# EAGLE design Emon3PVoltageV1.3 (EAGLE 6.4)
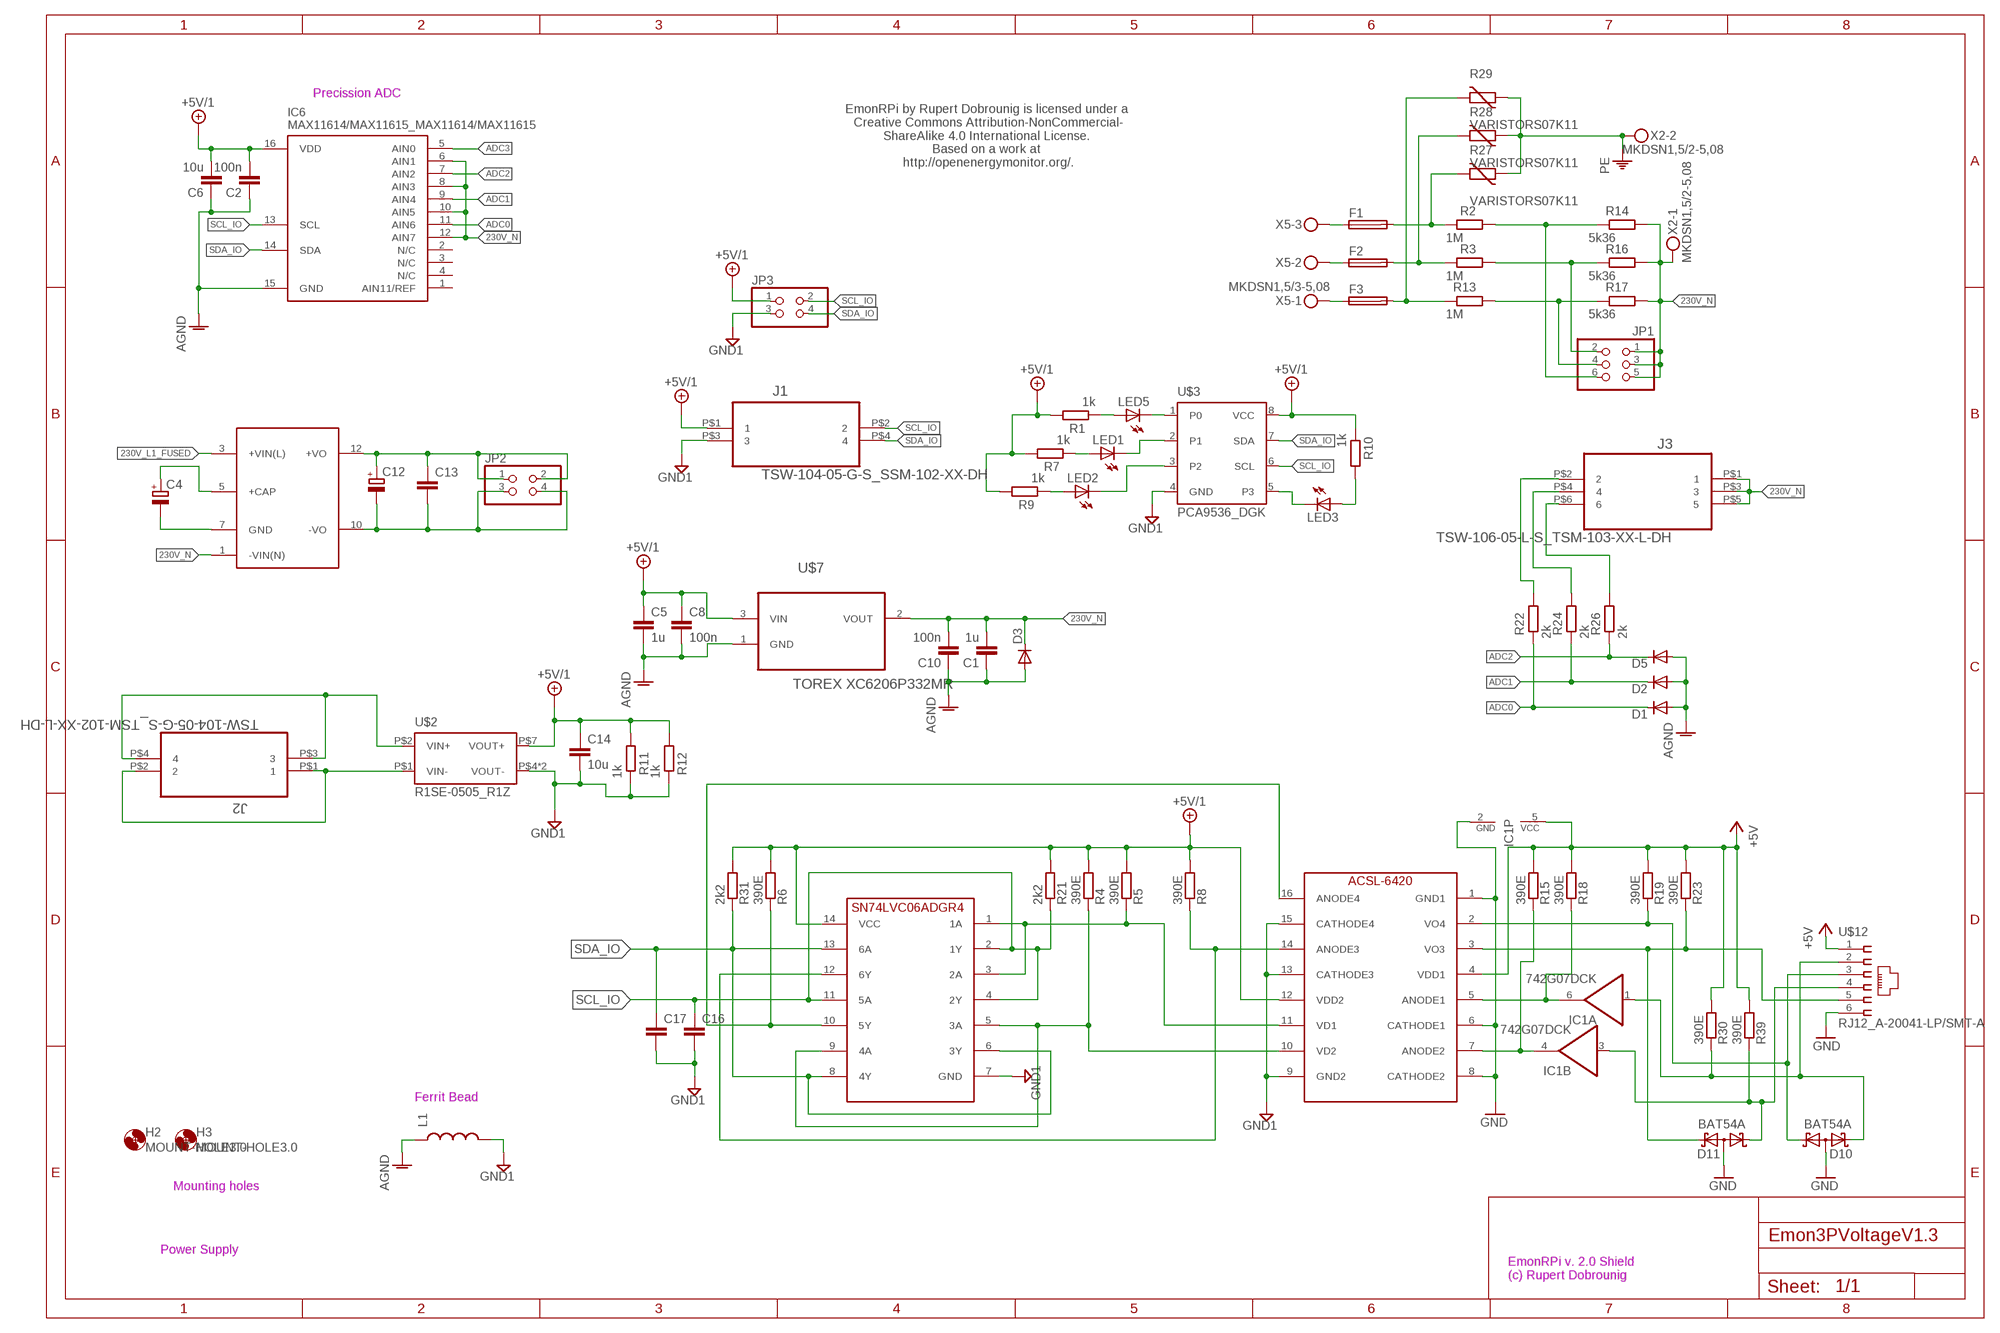
[diagram p0: schematic, sheet 1]

## Parts
C1  1u  C-EUC0805  [C0805]
C2  100n  C-EUC0805  [C0805]
C4  CPOL-EUE5-13  [E5-13]
C5  1u  C-EUC0805  [C0805]
C6  10u  C-EUC0805  [C0805]
C8  100n  C-EUC0805  [C0805]
C10  100n  C-EUC0805  [C0805]
C12  CPOL-EUE5-10.5  [E5-10,5]
C13  C-EUC0805  [C0805]
C14  10u  C-EUC0805  [C0805]
C16  C-EUC0805  [C0805]
C17  C-EUC0805  [C0805]
D1  DIODE-SOD523  [SOD523]
D2  DIODE-SOD523  [SOD523]
D3  DIODE-SOD523  [SOD523]
D5  DIODE-SOD523  [SOD523]
D10  BAT54A  [SOT23]
D11  BAT54A  [SOT23]
F1  TE5  [TE5]
F2  TE5  [TE5]
F3  TE5  [TE5]
H2  MOUNT-HOLE3.0  [3,0]
H3  MOUNT-HOLE3.0  [3,0]
IC1  742G07DCK  [SC70-6]
IC6  MAX11614/MAX11615_MAX11614/MAX11615  [QSOP16_2]
J1  TSW-104-05-G-S_SSM-102-XX-DH  [SAMTEC_SSM-102-XX-DH]
J2  TSW-104-05-G-S_TSM-102-XX-L-DH  [SAMTEC_TSM-102-XX-L-DH]
J3  TSW-106-05-L-S_TSM-103-XX-L-DH  [SAMTEC_TSM-103-XX-L-DH]
JP1  PINHD-2X3  [2X03]
JP2  PINHD-2X2  [2X02]
JP3  PINHD-2X2  [2X02]
L1  INDUCTOR0805  [0805]
LED1  LEDCHIPLED_1206  [CHIPLED_1206]
LED2  LEDCHIPLED_1206  [CHIPLED_1206]
LED3  LEDCHIPLED_1206  [CHIPLED_1206]
LED5  LEDCHIPLED_1206  [CHIPLED_1206]
R1  1k  R-EU_R1206  [R1206]
R2  1M  R-EU_0207/12  [0207/12]
R3  1M  R-EU_0207/12  [0207/12]
R4  390E  R-EU_R1206  [R1206]
R5  390E  R-EU_R1206  [R1206]
R6  390E  R-EU_R1206  [R1206]
R7  1k  R-EU_R1206  [R1206]
R8  390E  R-EU_R1206  [R1206]
R9  1k  R-EU_R1206  [R1206]
R10  1k  R-EU_R1206  [R1206]
R11  1k  R-EU_R1206  [R1206]
R12  1k  R-EU_R1206  [R1206]
R13  1M  R-EU_0207/12  [0207/12]
R14  5k36  R-EU_R1206  [R1206]
R15  390E  R-EU_R1206  [R1206]
R16  5k36  R-EU_R1206  [R1206]
R17  5k36  R-EU_R1206  [R1206]
R18  390E  R-EU_R1206  [R1206]
R19  390E  R-EU_R1206  [R1206]
R21  2k2  R-EU_R1206  [R1206]
R22  2k  R-EU_R1206  [R1206]
R23  390E  R-EU_R1206  [R1206]
R24  2k  R-EU_R1206  [R1206]
R26  2k  R-EU_R1206  [R1206]
R27  VARISTORS07K11  [S07K11]
R28  VARISTORS07K11  [S07K11]
R29  VARISTORS07K11  [S07K11]
R30  390E  R-EU_R1206  [R1206]
R31  2k2  R-EU_R1206  [R1206]
R39  390E  R-EU_R1206  [R1206]
U$1  LS03-15BXXSR2  [LS03]
U$2  R1SE-0505_R1Z  [R1Z]
U$3  PCA9536_DGK  [DGK_S-PDSO-G8]
U$7  TOREX XC6206P332MR  MCP1700T-3302E/TT  [SOT95P237X112-3N]
U$10  ACSL-6420  [SO16]
U$11  SN74LVC06ADRG4  [SO-14]
U$12  RJ12_A-20041-LP/SMT-A  [A-2004-1-LP-SMT-B]
X2  MKDSN1,5/2-5,08  [MKDSN1,5/2-5,08]
X5  MKDSN1,5/3-5,08  [MKDSN1,5/3-5,08]

## Nets
230V_L1_FUSED [power]: F1.2 R2.2 R27.2 U$1.3(+VIN(L))
230V_N [230N]: C1.2 C10.2 D3.C IC6.6(AIN1) IC6.8(AIN3) IC6.10(AIN5) IC6.12(AIN7) J3.P$1 J3.P$3 J3.P$5 JP1.1 JP1.3 JP1.5 R14.1 R16.1 R17.1 U$1.1(-VIN(N)) U$7.2(VOUT) X2.1
+5V: IC1.5(P:VCC) R15.2 R18.2 R19.2 R23.2 R30.2 R39.2 U$10.4(VDD1) U$12.1
+5V/1 [power-converted]: C2.2 C5.1 C6.2 C8.1 C14.1 IC6.16(VDD) J1.P$1 JP3.1 R1.1 R4.2 R5.2 R6.2 R7.1 R8.2 R9.1 R10.2 R11.1 R12.1 R21.2 R31.2 U$2.P$7(VOUT+) U$3.8(VCC) U$7.3(VIN) U$10.12(VDD2) U$11.14(VCC)
ADC0: D1.C IC6.11(AIN6) R22.2
ADC1: D2.C IC6.9(AIN4) R24.2
ADC2: D5.C IC6.7(AIN2) R26.2
ADC3: IC6.5(AIN0)
AGND [AGND]: C1.1 C2.1 C5.2 C6.1 C8.2 C10.1 D1.A D2.A D3.A D5.A IC6.15(GND) L1.1 U$7.1(GND)
GND: D10.3(AA) D11.3(AA) IC1.2(P:GND) U$10.1(GND1) U$10.6(CATHODE1) U$10.8(CATHODE2) U$12.6
GND1 [power-converted]: C14.2 C16.2 C17.2 J1.P$3 JP3.3 L1.2 R11.2 R12.2 U$2.P$4(VOUT-) U$2.P$5(VOUT-) U$3.4(GND) U$10.9(GND2) U$10.13(CATHODE3) U$10.15(CATHODE4) U$11.7(GND)
N$1: IC1.6(A:O) R18.1 U$10.5(ANODE1)
N$2: LED3.C U$3.5(P3)
N$3: C4.+ U$1.5(+CAP)
N$4 [230Midpoint]: J3.P$2 R22.1
N$5: LED5.A R1.2
N$6: LED2.A R9.2
N$7: LED1.A R7.2
N$8: R5.1 U$10.11(VD1) U$11.1(1A) U$11.3(2A)
N$9 [power]: F2.2 R3.2 R28.2
N$10: IC1.4(B:O) R15.1 U$10.7(ANODE2)
N$11 [power]: F3.2 R13.2 R29.2
N$12 [power-converted]: J2.P$3 J2.P$4 U$2.P$2(VIN+)
N$14: JP1.2 R3.1 R16.2
N$15 [power-converted]: J2.P$1 J2.P$2 U$2.P$1(VIN-)
N$16 [power]: F3.1 X5.1
N$17: R4.1 U$10.10(VD2) U$11.5(3A) U$11.9(4A)
N$18 [power]: F2.1 X5.2
N$19 [power]: F1.1 X5.3
N$20: C4.- U$1.7(GND)
N$21 [230Midpoint]: J3.P$6 R26.1
N$22: C12.- C13.2 JP2.3 JP2.4 U$1.10(-VO)
N$23: C12.+ C13.1 JP2.1 JP2.2 U$1.12(+VO)
N$24 [230Midpoint]: J3.P$4 R24.1
N$25: LED5.C U$3.1(P0)
N$26: JP1.4 R13.1 R17.2
N$27: LED1.C U$3.2(P1)
N$28: R6.1 U$10.16(ANODE4) U$11.10(5Y)
N$29: R8.1 U$10.14(ANODE3) U$11.12(6Y)
N$30: JP1.6 R2.1 R14.2
N$31: LED2.C U$3.3(P2)
N$32: LED3.A R10.1
PE [power]: R27.1 R28.1 R29.1 X2.2
SCL_IO: C16.1 IC6.13(SCL) J1.P$2 JP3.2 R21.1 U$3.6(SCL) U$11.2(1Y) U$11.4(2Y) U$11.11(5A)
SCL_RX_UC: D10.1(K1) R19.1 U$10.2(VO4) U$12.3
SCL_TX_UC: D10.2(K2) IC1.1(A:I) R30.1 U$12.2
SDA_IO: C17.1 IC6.14(SDA) J1.P$4 JP3.4 R31.1 U$3.7(SDA) U$11.6(3Y) U$11.8(4Y) U$11.13(6A)
SDA_RY_UC: D11.2(K2) R23.1 U$10.3(VO3) U$12.5
SDA_TY_UC: D11.1(K1) IC1.3(B:I) R39.1 U$12.4
Unconnected: IC6.1(AIN11/REF) IC6.2(N/C) IC6.3(N/C) IC6.4(N/C)

## Notes on the sheet
- Precission ADC
- EmonRPi by Rupert Dobrounig is licensed under a
   Creative Commons Attribution-NonCommercial-
  ShareAlike 4.0 International License.
  Based on a work at
   http://openenergymonitor.org/.
- Ferrit Bead
- Mounting holes
- Power Supply
- EmonRPi v. 2.0 Shield
  (c) Rupert Dobrounig

## Library data of the parts
C1 C2 C5 C6 C8 C10 C13 C14 C16 C17 = rcl:C-EU: CAPACITOR, European symbol
C4 C12 = rcl:CPOL-EU: POLARIZED CAPACITOR, European symbol
D1-D3 D5 = diode:DIODE-: DIODE
D10 D11 = diode:BAT54A: Schottky Diodes Source: Fairchild .. BAT54.pdf
F1-F3 = fuse:TE5: FUSE Wickmann; OC_FARNELL: unknown; OC_NEWARK: unknown
H2 H3 = holes:MOUNT-HOLE: MOUNTING HOLE with drill center marker
IC1 = rdob-devices:74*2G07: Single Buffer/Driver With Open-Drain Output
IC6 = rdob-devices:MAX11614/MAX11615: Maxim Integrated 12 Bit 8 Channel I2C ADC
J1 J2 = rdob-devices:TSW-104-05-G-S: POST HEADER , THROUGH-HOLE
J3 = rdob-devices:TSW-106-05-L-S: HEADER,THT VERT,6 WAY
JP1 = pinhead:PINHD-2X3: PIN HEADER
JP2 JP3 = pinhead:PINHD-2X2: PIN HEADER
L1 = SparkFun:INDUCTOR: Inductors Basic Inductor/Choke - 0603 and 1206. Footprints are not proven and vary greatly between part numbers.; RS: 724-1536
LED1-LED3 LED5 = led:LED: LED OSRAM: - CHIPLED LG R971, LG N971, LY N971, LG Q971, LY Q971, LO R971, LY R971 LH N974, LH R974 LS Q976, LO Q976, LY Q976 LO Q996 - Hyper CHIPLED LW Q18S LB Q993, LB Q99A, LB R99A - SideLED LS A670, LO A670, LY A670, LG A670, LP A670 LB A673, LV A673, LT A673, LW A673 LH A674 LY A675 LS A676, LA A676, LO A676, LY A676, LW A676 LS A679, LY A679, LG A679 - Hyper Micro SIDELED® LS Y876, LA Y876, LO Y876, LY Y876 LT Y87S - SmartLED LW L88C, LW L88S LB L89C, LB L89S, LG L890 LS L89K, LO L89K, LY L89K LS L896, LA L896, LO L896, LY L896 - TOPLED LS T670, LO T670, LY T670, LG T670, LP T670 LSG T670, LSP T670, LSY T670, LOP T670, LYG T670 LG T671, LOG T671, LSG T671 LB T673, LV T673, LT T673, LW T673 LH T674 LS T676, LA T676, LO T676, LY T676, LB T676, LH T676, LSB T676, LW T676 LB T67C, LV T67C, LT T67C, LS T67K, LO T67K, LY T67K, LW E67C LS E67B, LA E67B, LO E67B, LY E67B, LB E67C, LV E67C, LT E67C LW T67C LS T679, LY T679, LG T679 LS T770, LO T770, LY T770, LG T770, LP T770 LB T773, LV T773, LT T773, LW T773 LH T774 LS E675, LA E675, LY E675, LS T675 LS T776, LA T776, LO T776, LY T776, LB T776 LHGB T686 LT T68C, LB T68C - Hyper Mini TOPLED® LB M676 - Mini TOPLED Santana® LG M470 LS M47K, LO M47K, LY M47K Source: http://www.osram.convergy.de LUXEON: - LUMILED® LXK2-PW12-R00, LXK2-PW12-S00, LXK2-PW14-U00, LXK2-PW14-V00 LXK2-PM12-R00, LXK2-PM12-S00, LXK2-PM14-U00 LXK2-PE12-Q00, LXK2-PE12-R00, LXK2-PE12-S00, LXK2-PE14-T00, LXK2-PE14-U00 LXK2-PB12-K00, LXK2-PB12-L00, LXK2-PB12-M00, LXK2-PB14-N00, LXK2-PB14-P00, LXK2-PB14-Q00 LXK2-PR12-L00, LXK2-PR12-M00, LXK2-PR14-Q00, LXK2-PR14-R00 LXK2-PD12-Q00, LXK2-PD12-R00, LXK2-PD12-S00 LXK2-PH12-R00, LXK2-PH12-S00 LXK2-PL12-P00, LXK2-PL12-Q00, LXK2-PL12-R00 Source: www.luxeon.com KINGBRIGHT: KA-3528ASYC Source: www.kingbright.com
R1-R19 R21-R24 R26 R30 R31 R39 = rcl:R-EU_: RESISTOR, European symbol
R27-R29 = varistor:VARISTOR: VARISTOR
U$1 = rdob-devices:LS03
U$2 = rdob-devices:R1SE-0505
U$3 = rdob-devices:PCA9536
U$7 = Farnell_MCP1700-SOT23:MCP1700T-3302E/TT: Low Quiescent Current LDO; MPN: MCP1700T-3302E/TT; OC_FARNELL: 1296592; OC_NEWARK: 88H9817; PACKAGE: SOT23-3; SUPPLIER: Microchip
U$10 = avago:ACSL-6420
U$11 = texas:SN74LVC06ADRG4
U$12 = rdob-devices:RJ12
X2 = con-phoenix-508:MKDSN1,5/2-5,08: MKDSN 1,5/ 2-5,08 Printklemme Nennstrom: 13,5 A Nennspannung: 250 V Rastermaß: 5,08 mm Polzahl: 2 Anschlussart: Schraubanschluss Montage: Löten Anschlussrichtung Leiter/Platine: 0 ° Artikelnummer: 1729128 Source: http://eshop.phoenixcontact.com .. 1729128.pdf; MPN: MKDSN 1,5/2-5.08; OC_FARNELL: 1792903; OC_NEWARK: 30M2397
X5 = con-phoenix-508:MKDSN1,5/3-5,08: MKDSN 1,5/ 3-5,08 Printklemme Nennstrom: 13,5 A Nennspannung: 250 V Rastermaß: 5,08 mm Polzahl: 3 Anschlussart: Schraubanschluss Montage: Löten Anschlussrichtung Leiter/Platine: 0 ° Artikelnummer: 1729131 Source: http://eshop.phoenixcontact.com .. 1729131.pdf; MPN: SMKDSN1,5/3-5,08; OC_FARNELL: 1792904; OC_NEWARK: 70R0299

## Net classes
1 power: width 0.305 mm, drill 0.6 mm, clearance 3 mm
2 gnd: width 0.254 mm, drill 0.6 mm, clearance 0.254 mm
4 AGND: clearance 0.953 mm to class 3
5 230N: clearance 0.55 mm to class 4
6 230Midpoint: clearance 0.55 mm to class 4

## Board
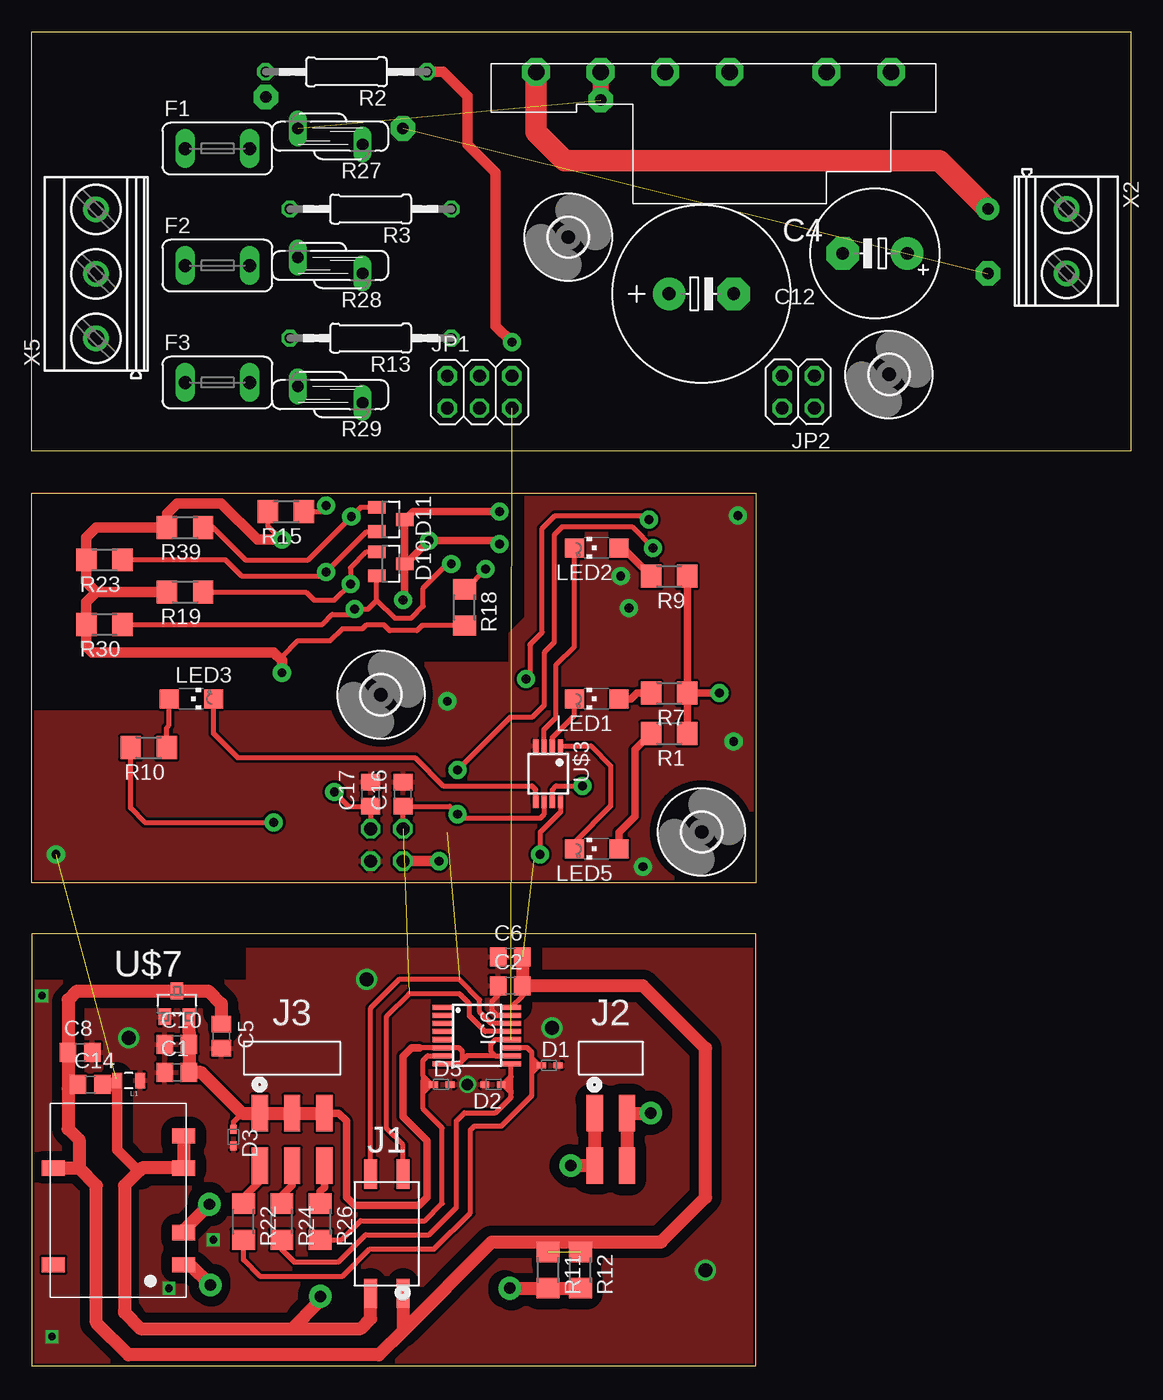
[diagram p1: board, top side]
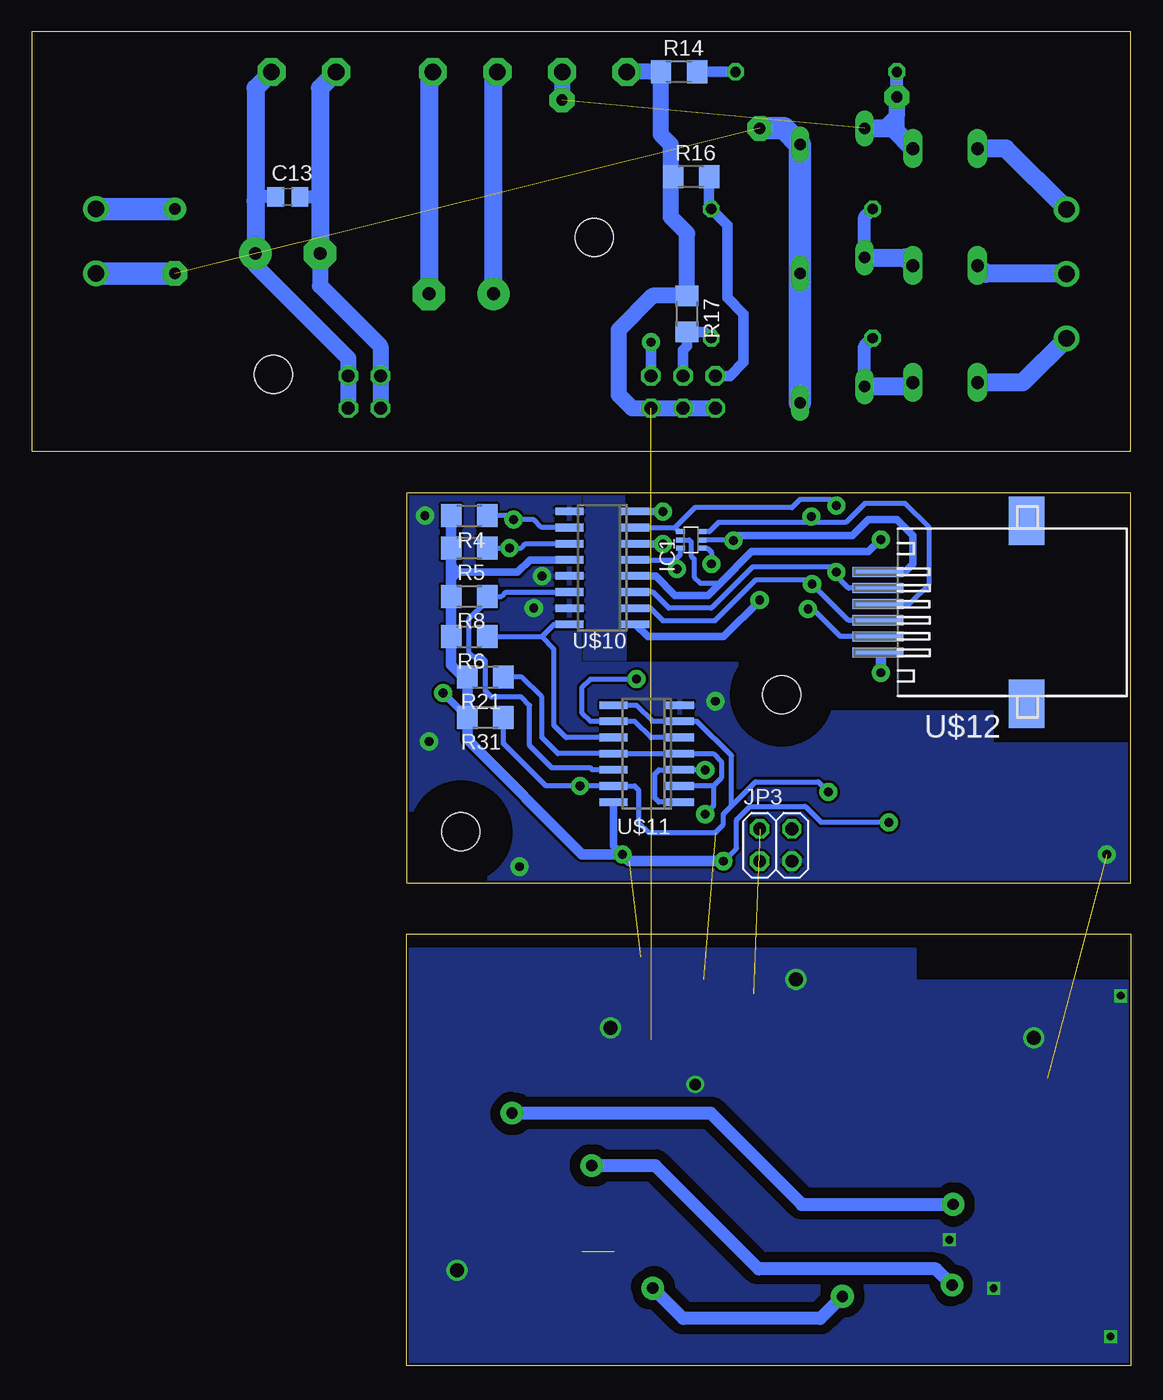
[diagram p2: board, bottom side, seen from below]

Size 86.5 x 105 mm. Coordinates in mm from the lower left corner, seen from the top.
Outline: 0,105 86.5,105 86.5,72 0,72 0,105
Outline: 0,68.7 57,68.7 57,38 0,38 0,68.7
Outline: 0,0 57,0 57,34 0,34 0,0
Copper layers (1*16): Top 0.035mm / dielectric 1.5mm / Bottom 0.035mm
Design rules "default *": minimum track width 16mil, minimum drill 24mil, track to track 0.2mm, track to pad 0.2mm, pad to pad 0.2mm, via to via 0.2mm, smd to smd 0.2mm, copper to edge 0.2mm, drill to drill 8mil, minimum pad ring 10mil, minimum via ring 8mil, stop-mask expansion 4mil, vias tented up to drill 0mil, thermal gap 0.2mm
tRestrict: area -0.6,71 to 87.6,106; area -0.3,30.4 to 57.5,33.9; 160 lines
bRestrict: area -0.6,71 to 87.6,106; area -0.3,30.4 to 57.5,33.9; 64 lines

### Footprints (pad centres in the part's own frame; a part is rotated, then mirrored left to right if it is on the bottom)
C0805 = smd 1.3 x 1.5: 1 -0.95,0; 2 0.95,0
E5-13 = drill 1.016 pad 2.54: + -2.54,0 | drill 1.016 pad 2.54 octagon: - 2.54,0
E5-10,5 = drill 1.016 pad 2.54: + -2.54,0 | drill 1.016 pad 2.54 octagon: - 2.54,0
SOD523 = smd 0.7 x 0.5: A 0.7,0; C -0.6,0
SOT23 = smd 1 x 1.4: 1 -0.95,-1.1; 2 0.95,-1.1; 3 0,1.1
TE5 = drill 1.016 long: 1 -2.54,0; 2 2.54,0
3,0 = hole 3: 0,0
SC70-6 = smd 0.4 x 0.7: 1 -0.65,-0.85; 2 0,-0.85; 3 0.65,-0.85; 4 0.65,0.85; 5 0,0.85; 6 -0.65,0.85
QSOP16_2 = smd 0.4 x 1.55: 1 -2.223,-2.7; 2 -1.588,-2.7; 3 -0.953,-2.7; 4 -0.318,-2.7; 5 0.318,-2.7; 6 0.953,-2.7; 7 1.588,-2.7; 8 2.223,-2.7; 9 2.223,2.7; 10 1.588,2.7; 11 0.953,2.7; 12 0.318,2.7; 13 -0.318,2.7; 14 -0.953,2.7; 15 -1.588,2.7; 16 -2.223,2.7
SAMTEC_SSM-102-XX-DH = smd 1.02 x 2.285: P$1 1.27,-4.697; P$2 1.27,4.697; P$3 -1.27,-4.697; P$4 -1.27,4.697
SAMTEC_TSM-102-XX-L-DH = smd 1.27 x 2.86: P$1 -1.27,-5.606; P$2 -1.27,-9.736; P$3 1.27,-5.606; P$4 1.27,-9.736
SAMTEC_TSM-103-XX-L-DH = smd 1.27 x 2.86: P$1 -2.54,-5.606; P$2 -2.54,-9.736; P$3 0,-5.606; P$4 0,-9.736; P$5 2.54,-5.606; P$6 2.54,-9.736
2X03 = drill 1.016 octagon: 1 -2.54,-1.27; 2 -2.54,1.27; 3 0,-1.27; 4 0,1.27; 5 2.54,-1.27; 6 2.54,1.27
2X02 = drill 1.016 octagon: 1 -1.27,-1.27; 2 -1.27,1.27; 3 1.27,-1.27; 4 1.27,1.27
0805 = smd 0.8 x 1.2: 1 -0.9,0; 2 0.9,0
CHIPLED_1206 = smd 1.5 x 1.5: A 0,-1.75; C 0,1.75
R1206 = smd 1.6 x 1.803: 1 -1.422,0; 2 1.422,0
0207/12 = drill 0.813 octagon: 1 -6.35,0; 2 6.35,0
S07K11 = drill 0.914 long: 1 -0.635,-2.54; 2 0.635,2.54
LS03 = drill 1.3 pad 2.184 octagon: 1 -15.24,-0.65; 3 -10.16,-0.65; 5 -5.08,-0.65; 7 0,-0.65; 10 7.62,-0.65; 12 12.7,-0.65
R1Z = smd 1.2 x 1.8: P$1 -5.08,-5.15; P$2 -2.54,-5.15; P$4 2.54,-5.15; P$5 5.08,-5.15; P$7 2.54,5.1; P$10 -5.08,5.1
DGK_S-PDSO-G8 = smd 0.4 x 1: 1 -0.975,-2.2; 2 -0.325,-2.2; 3 0.325,-2.2; 4 0.975,-2.2; 5 0.975,2.2; 6 0.325,2.2; 7 -0.325,2.2; 8 -0.975,2.2
SOT95P237X112-3N = smd 0.991 x 1.321: 1 -0.94,-1.016; 2 0.94,-1.016; 3 0,1.016
SO16 = smd 0.6 x 2.2: 1 -4.445,-2.6; 2 -3.175,-2.6; 3 -1.905,-2.6; 4 -0.635,-2.6; 5 0.635,-2.6; 6 1.905,-2.6; 7 3.175,-2.6; 8 4.445,-2.6; 9 4.445,2.6; 10 3.175,2.6; 11 1.905,2.6; 12 0.635,2.6; 13 -0.635,2.6; 14 -1.905,2.6; 15 -3.175,2.6; 16 -4.445,2.6
SO-14 = smd 0.6 x 2.2: 1 -3.81,-2.6; 2 -2.54,-2.6; 3 -1.27,-2.6; 4 0,-2.6; 5 1.27,-2.6; 6 2.54,-2.6; 7 3.81,-2.6; 8 3.81,2.6; 9 2.54,2.6; 10 1.27,2.6; 11 0,2.6; 12 -1.27,2.6; 13 -2.54,2.6; 14 -3.81,2.6
A-2004-1-LP-SMT-B = smd 0.8 x 4: 1 -3.175,19.6; 2 -1.905,19.6; 3 -0.635,19.6; 4 0.635,19.6; 5 1.905,19.6; 6 3.175,19.6 | smd 3.8 x 2.8: P$1 7.2,7.88; P$2 -7.2,7.88
MKDSN1,5/2-5,08 = drill 1.3 pad 2: 1 -2.561,0.025; 2 2.519,0.025
MKDSN1,5/3-5,08 = drill 1.3 pad 2: 1 -7.641,0.025; 2 -2.561,0.025; 3 2.519,0.025

### Placement (x,y rotation side)
C1  11.43,23.1 0 top
C2  37.66,29.93 0 top
C4  52.7,84.38 0 top
C5  14.92,25.96 270 top
C6  37.66,32.19 0 top
C8  3.81,24.69 0 top
C10  11.43,25.33 0 top
C12  66.36,87.56 180 top
C13  66.36,92 0 bottom
C14  4.6,22.15 0 top
C16  29.21,45 90 top
C17  26.67,45 90 top
D1  40.72,23.66 0 top
D2  36.35,22.15 180 top
D3  15.88,18.02 270 top
D5  32.23,22.15 0 top
D10  28.26,63.13 270 top
D11  28.26,66.62 270 top
F1  14.61,95.81 0 top
F2  14.61,86.61 0 top
F3  14.61,77.4 0 top
H1  MOUNT-HOLE3.0  [3,0]  27.48,52.83 0 top
H2  52.72,42.03 0 top
H3  67.47,78.03 0 top
H4  MOUNT-HOLE3.0  [3,0]  42.23,88.83 0 top
IC1  34.61,65.02 90 bottom
IC6  35.04,26 270 top
J1  27.94,10.41 0 top
J2  45.58,25.49 0 top
J3  20.49,25.5 0 top
JP1  35.24,76.65 0 top
JP2  60.33,76.65 180 top
JP3  27.94,41 0 bottom
L1  7.63,22.46 180 top
LED1  44.45,52.5 90 top
LED2  44.45,64.38 90 top
LED3  12.55,52.5 270 top
LED5  44.45,40.7 90 top
R1  50.16,49.77 180 top
R2  24.77,101.84 180 top
R3  26.67,91.05 180 top
R4  52.07,66.92 180 bottom
R5  52.07,64.38 180 bottom
R6  52.07,57.39 180 bottom
R7  50.16,52.95 180 top
R8  52.07,60.57 180 bottom
R9  50.16,62.16 180 top
R10  9.21,48.66 180 top
R11  40.64,7.55 270 top
R12  43.18,7.55 270 top
R13  26.67,80.89 180 top
R14  35.56,101.84 0 bottom
R15  20,67.24 180 top
R16  34.61,93.59 0 bottom
R17  34.92,82.8 270 bottom
R18  34.05,59.7 270 top
R19  12.06,60.91 180 top
R21  50.8,54.22 180 bottom
R22  16.67,11.36 270 top
R23  5.71,63.45 180 top
R24  19.68,11.36 270 top
R26  22.7,11.36 270 top
R27  23.5,96.77 90 top
R28  23.5,86.61 90 top
R29  23.5,76.44 90 top
R30  5.71,58.37 180 top
R31  50.8,51.05 180 bottom
R39  12.06,65.98 180 top
U$1  54.93,102.48 0 top
U$2  6.79,13.04 90 top
U$3  40.64,46.6 180 top
U$7  11.43,28.5 0 top
U$10  41.59,62.81 90 bottom
U$11  38.1,48.19 90 bottom
U$12  0.32,59.32 90 bottom
X2  81.42,88.51 270 top
X5  5.08,88.51 90 top

### Tracks (layer width: path | path; a pad name or v marks a point on that pad's centre or on a via)
230V_L1_FUSED  (via drill 0.9 pad 1.93)  (1 unrouted)
  Top 1.27: U$1.3 v44.77,99.62
  Bottom 1.016: v18.41,99.86 R2.2
  Bottom 1.27: U$1.3 v44.77,99.62 | F1.2 18.41,97.08 v18.41,99.86 18.41,98.35 19.37,97.4
  Bottom 1.422: R27.2 19.37,97.4 18.73,97.4 F1.2
230V_N  (via drill 0.9 pad 1.78)  (1 unrouted)
  Top 0.406: IC6.8 33.62,23.78 33.89,24.06 | 33.89,24.06 33.89,24.77 33.62,25.05 IC6.6 30.52,25.05 | IC6.12 36.47,25.68 36.12,25.33 36.12,24.77 36.47,24.41 | 36.47,24.41 IC6.10 | 36.47,24.41 34.25,24.41 33.89,24.06 | D3.C 15.88,19.22 16.55,19.89
  Top 0.61: 30.52,25.05 29.88,25.05 29.21,24.38 29.21,19.61 31.11,17.71 31.11,13.26 30.48,12.63 25.4,12.63 24.77,13.26 24.77,19.3 24.17,19.89 J3.P$5
  Top 1.016: J3.P$5 J3.P$3 J3.P$1 16.55,19.89 13.34,23.1 C1.2 C10.2 12.38,26.28 12.37,26.29 U$7.2
  Top 1.676: v75.25,91.05 71.44,94.86 41.91,94.86 39.69,97.08 U$1.1
  Bottom 0.61: 39.38,101.84 39.67,101.84 U$1.1
  Bottom 0.813: R16.1 36.2,93.59
  Bottom 1.27: 39.38,101.84 R14.1 36.98,96.92 36.2,96.13 36.2,93.59 36.2,90.41 34.92,89.14 R17.1 37.63,84.22 40.32,81.53 40.32,76.44 39.26,75.38 JP1.5 JP1.3 JP1.1
  Bottom 1.778: v75.25,91.05 81.42,91.05 X2.1
+5V  (via drill 0.7 pad 1.42)
  Top 0.406: R15.2 18.58,66.14 v19.68,65.03 | R18.2 30.73,58.27 30.32,57.87 28.18,57.87 27.7,58.35 26.35,58.35 26.04,58.03 24.45,58.03 23.5,57.08 20.95,57.08 19.68,55.81 v19.68,54.55
  Top 0.813: v19.68,54.55 19.68,55.51 19.05,56.14 4.76,56.14 4.29,56.61 R30.2 4.29,60.12 5.08,60.91 | R19.2 5.08,60.91 | 5.08,60.91 4.29,61.69 R23.2 4.29,65.2 5.08,65.98 R39.2 10.64,67.1 11.43,67.89 14.92,67.89 17.78,65.03 v19.68,65.03
  Bottom 0.406: IC1.5 34.77,65.02 34.61,64.86 34.61,63.74 34.37,63.51 34.37,62.1 33.88,61.61 32.31,61.61
  Bottom 0.61: v19.68,65.03 20.64,64.08 29.84,64.08 32.31,61.61 33.28,60.65 35.88,60.65 37.39,62.16 38.42,62.16 38.44,62.17 U$10.4
  Bottom 0.813: U$12.1 19.68,55.91 v19.68,54.55
+5V/1  (via drill 0.7 pad 1.42)  (2 unrouted)
  Top 0.406: U$3.8 41.62,43.61 40.01,42 v40.01,40.25 | v19.05,42.79 8.89,42.79 7.78,43.9 R10.2 | 5.08,5.16 5.08,3.42 | C2.2 38.61,29.1 IC6.16
  Top 0.61: R1.1 R7.1 | R7.1 R9.1 | R7.1 v54.13,52.95
  Top 0.813: v32.05,39.73 JP3.1
  Top 1.016: J1.P$1 29.21,2.78 | 29.21,2.78 27.3,0.88 7.62,0.88 5.08,3.42 5.08,14.22 3.71,15.58 | U$2.P$7 3.71,15.58 | 29.21,2.78 36.2,9.77 40.32,9.77 | 40.32,9.77 49.53,9.77 53.02,13.26 53.02,25.01 48.1,29.93 C2.2 C6.2 | 2.86,21.84 C8.1 2.86,28.82 3.56,29.52 U$7.3 13.91,29.52 14.92,28.5 C5.1 | 2.86,21.84 2.86,18.66 3.71,17.8 3.71,15.58 | C14.1 3.18,22.15 2.86,21.84 | R11.1 40.64,9.45 40.32,9.77
  Bottom 0.406: v32.05,39.73 31.04,40.74 31.04,42.99 29.99,44.04 25.62,44.04 24.36,42.79 v19.05,42.79
  Bottom 0.61: U$10.12 47.29,63.45 48.26,62.48 52.86,62.48 | 52.86,62.48 53.49,63.11 | 52.86,62.48 53.5,61.83 53.5,61.52 | U$11.14 40.7,40.95 v40.01,40.25 | v54.13,52.95 52.22,51.04
  Bottom 0.813: R4.2 R5.2 53.49,63.11 R8.2 R6.2 53.49,55.17 52.54,54.22 R21.2 R31.2 52.22,51.04 52.22,49.29 43.18,40.25 v40.01,40.25 39.48,39.73 v32.05,39.73
ADC0
  Top 0.406: IC6.11 39.01,25.05 39.37,24.69 39.37,24.22 | R22.2 16.67,8.34 17.94,7.07 24.45,7.07 26.59,9.21 31.67,9.21 34.53,12.07 34.53,18.58 34.85,18.9 36.99,18.9 39.37,21.28 39.37,23.1 | 39.37,23.42 39.37,24.22 | 39.93,23.66 39.37,24.22 | D1.C 39.93,23.66 | 39.93,23.66 39.37,23.1 | 39.37,23.1 39.37,23.42 | 39.37,23.42 39.69,23.74
ADC1
  Top 0.406: 37.74,21.62 37.74,21.16 36.51,19.93 34.05,19.93 33.42,19.3 33.42,12.47 31.27,10.33 26.27,10.33 24.13,8.18 20.64,8.18 19.68,9.13 R24.2 | 37.74,21.62 37.74,22.79 | 37.74,22.79 IC6.9 | D2.C 37.1,22.15 | 37.1,22.15 37.74,22.79 | 37.1,22.15 37.74,21.52 | 37.74,21.62 37.47,21.89 37.47,22.15
ADC2
  Top 0.406: R26.2 24.38,9.94 25.88,11.44 30.96,11.44 32.31,12.79 32.31,18.74 30.8,20.25 30.8,21.52 | 30.8,21.52 30.8,22.47 | 30.8,22.79 30.8,24.06 31.15,24.41 IC6.7 | 31.43,22.15 30.8,21.52 | D5.C 31.43,22.15 | 31.43,22.15 30.8,22.79 | 30.8,22.79 30.8,22.47 | 30.8,22.47 31.11,22.15
AGND  (via drill 0.6, 0.9 pad 1.27, 1.1 pad 1.27)
  Top 0.406: IC6.15 36.63,27.59 36.23,27.99 36.23,28.7 36.71,29.18 C2.1
  other vias: 7.62,25.8 34.29,22.15 26.35,30.41 40.96,26.6 53.02,7.55 0.79,29.14 1.59,2.31 10.79,6.12 14.29,9.93
  pour Bottom: -1.91,35.17 58.42,35.17 58.42,-1.03 -1.91,-1.03
  pour Top: -3.49,35.17 58.42,35.17 58.42,-1.03 -3.49,-1.03
GND  (via drill 0.7 pad 1.42)
  Top 0.61: v36.83,67.25 29.99,67.25 D11.3 D10.3 | D10.3 29.36,63.04 v31.27,64.95 36.57,64.95 v36.83,64.7 | D10.3 29.36,60.42 v29.21,60.27
  Bottom 0.406: IC1.2 31.34,65.02 v31.27,64.95
  Bottom 0.61: v31.27,64.95 31.27,64.94 30.86,65.35 21.91,65.35 20.64,66.62 18.41,66.62 17.14,65.35 17.14,63.13 17.78,62.49 U$12.6 | v36.83,67.25 U$10.8 | v36.83,64.7 38.98,64.7 U$10.6 | v29.21,60.27 29.21,60.25 32.07,57.39 38.02,57.39 U$10.1
GND1  (via drill 0.7 pad 1.42, 0.9 pad 1.78)  (1 unrouted)
  Top 0.406: 7.3,5.16 7.3,4.37
  Top 0.61: 6.72,21.52 6.09,22.15 C14.2 6.11,22.15 6.59,22.63
  Top 0.813: L1.2 6.72,21.52 6.72,17.02 8.41,15.33
  Top 1.016: 20.47,2.94 8.57,2.94 7.3,4.21 7.3,4.37 7.3,14.22 8.41,15.33 8.67,15.58 U$2.P$4 U$2.P$5 | 20.47,2.94 25.88,2.94 26.67,3.74 J1.P$3 | 20.47,2.94 22.54,5.01 v22.7,5.48 | v37.62,6.12 40.63,6.12 | 40.63,6.12 R11.2 | 40.63,6.12 43.17,6.12 R12.2
  Bottom 1.016: v22.7,5.48 24.45,3.74 35.24,3.74 v37.62,6.12
  other vias: 55.56,66.92 46.35,62.17 55.24,49.14 48.1,39.3 46.99,59.63 32.7,52.31 1.91,40.25
  pour Top: 59.69,69.46 37.47,69.46 37.47,55.49 27.94,55.49 27.94,51.68 -0.64,51.68 -0.64,37.08 59.69,37.08
  pour Bottom: 59.69,69.46 40.01,69.46 39.91,55.49 27.94,55.49 27.94,51.68 10.79,51.68 10.79,49.14 -0.64,49.14 -0.64,37.08 59.69,37.08
N$1  (via drill 0.7 pad 1.42)
  Top 0.406: v35.72,62.71 34.12,61.12 R18.1
  Bottom 0.406: U$10.5 38.98,63.43 35.88,63.43 | 35.88,63.43 35.46,63.85 IC1.6 | v35.72,62.71 35.72,63.27 35.88,63.43
N$2
  Top 0.406: U$3.5 39.66,45.35 39.37,45.65 32.38,45.65 30.16,47.87 16.19,47.87 14.3,49.76 LED3.C
N$3
  Bottom 1.422: C4.+ 50.16,101.51 U$1.5
N$4
  Top 0.61: J3.P$2 17.95,14.55 16.67,13.26 R22.1
N$5
  Top 0.61: LED5.A 46.2,42 47.47,43.27 47.47,48.5 47.55,48.58 R1.2
N$6
  Top 0.61: R9.2 48.58,62.16 48.58,62.32 46.51,64.38 LED2.A
N$7
  Top 0.61: R7.2 47.62,52.95 47.17,52.5 LED1.A
N$8  (via drill 0.7 pad 1.42)
  Top 0.406: v33.5,46.92 37.62,51.05 39.37,51.05 40.32,52 40.32,56.14 41.12,56.94 41.12,65.41 41.75,66.05 47.23,66.05 v48.9,64.38
  Bottom 0.406: U$10.11 47.62,64.72 47.96,64.38 v48.9,64.38 R5.1 | U$11.1 37.15,44.38 37.47,44.7 37.47,46.6 37.15,46.92 U$11.3 v33.5,46.92
N$9
  Bottom 1.016: R28.2 20.95,90.41 R3.2
  Bottom 1.422: R28.2 17.78,87.24 F2.2
N$10  (via drill 0.7 pad 1.42)
  Top 0.406: R15.1 22.7,67.24 v23.18,67.71
  Bottom 0.406: U$10.7 35.9,65.98 | 35.9,65.98 35.58,65.67 IC1.4 | v23.18,67.71 23.65,68.19 26.04,68.19 26.67,67.56 34.33,67.56 35.9,65.98
N$11
  Bottom 1.016: R29.2 20.95,80.25 R13.2
  Bottom 1.422: R29.2 17.46,77.08 F3.2
N$12  (via drill 0.9 pad 1.78)
  Top 1.016: v13.99,12.72 11.95,10.68 U$2.P$2 | J2.P$4 J2.P$3 v48.7,19.89
  Bottom 1.016: v48.7,19.89 33.06,19.89 25.89,12.72 v13.99,12.72
N$14
  Bottom 0.813: R16.2 33.19,91.22 R3.1 31.75,89.78 31.75,84.06 30.48,82.8 30.48,78.98 31.55,77.92 JP1.2
N$15  (via drill 0.9 pad 1.78)
  Top 1.016: v14.06,6.37 12.48,7.96 U$2.P$1 | J2.P$1 J2.P$2 v42.43,15.76
  Bottom 1.016: v14.06,6.37 15.34,7.64 29.3,7.64 37.42,15.76 v42.43,15.76
N$16
  Bottom 1.422: X5.1 8.53,77.4 F3.1
N$17  (via drill 0.7 pad 1.42)
  Top 0.406: v38.89,54.06 39.21,54.38 39.21,56.78 40.16,57.73 40.16,65.89 41.2,66.92 48.26,66.92 v48.58,66.6
  Bottom 0.406: U$11.5 37.78,49.46 39.05,50.73 U$11.9 42.55,50.73 43.18,51.36 43.18,53.43 42.55,54.06 v38.89,54.06 | U$10.10 46.37,65.98 46.99,66.6 v48.58,66.6 48.9,66.92 R4.1
N$18
  Bottom 1.422: X5.2 11.41,85.95 F2.1
N$19
  Bottom 1.422: X5.3 9.84,95.81 F1.1
N$20
  Bottom 1.422: U$1.7 55.24,101.51 C4.-
N$21
  Top 0.61: J3.P$6 23.03,14.07 22.7,13.74 R26.1
N$22
  Bottom 1.016: C13.2 64.14,92 63.82,92.32
  Bottom 1.27: C12.- 63.82,85.02 59.05,80.25 JP2.3 JP2.4
  Bottom 1.422: U$1.10 63.82,100.56 63.82,92.32 C12.-
N$23
  Bottom 1.016: C13.1 68.58,92 68.9,91.69
  Bottom 1.27: C12.+ 68.9,86.61 61.59,79.3 JP2.1 JP2.2
  Bottom 1.422: U$1.12 68.9,100.56 68.9,91.69 C12.+
N$24
  Top 0.61: J3.P$4 20.49,14.23 19.68,13.42 R24.1
N$25
  Top 0.406: U$3.1 44,48.8 45.56,47.23 45.56,44.06 42.7,41.2 LED5.C
N$26
  Bottom 0.813: R17.2 35.08,81.37 | R17.2 33.5,81.37 R13.1 | R17.2 34.92,80.25 35.24,79.94 JP1.4
N$27
  Top 0.406: U$3.2 40.97,49.47 42.7,51.2 LED1.C
N$28
  Bottom 0.406: R6.1 46.35,57.39 | U$10.16 45.38,58.37 46.35,57.39 | U$11.10 44.45,49.46 45.4,50.41 45.4,56.44 46.35,57.39
N$29
  Bottom 0.406: U$10.14 49.2,60.91 49.53,60.57 R8.1 50.65,60.25 51.44,59.46 52.07,58.83 52.07,56.12 51.75,55.81 51.12,55.81 50.8,55.49 50.8,53.11 50.32,52.63 47.94,52.63 47.31,52 47.31,48.82 45.56,47.08 42.55,47.08 42.39,46.92 U$11.12
N$30  (via drill 0.7 pad 1.42)
  Top 0.813: R2.1 32.38,101.84 34.29,99.94 34.29,96.13 36.51,93.91 36.51,81.84 v37.78,80.57
  Bottom 0.813: R2.1 R14.2 | v37.78,80.57 JP1.6
N$31
  Top 0.406: LED2.C 42.7,56.62 41.27,55.19 41.27,51.05 40.31,50.09 U$3.3
N$32
  Top 0.406: R10.1 10.63,50.24 10.8,50.41 LED3.A
PE  (via drill 0.9 pad 1.93)  (1 unrouted)
  Bottom 1.778: R29.1 R28.1 R27.1 27.3,97.4 v29.21,97.4 | v75.25,85.97 81.42,85.97 X2.2
SCL_IO  (via drill 0.7 pad 1.42)  (1 unrouted)
  Top 0.406: U$3.6 40.31,43.42 40.01,43.11 33.81,43.11 v33.5,43.42 v33.5,43.43 32.88,44.05 C16.1 JP3.2 | IC6.13 35.68,26.32 34.45,27.55 34.45,28.5 33.66,29.3 29.69,29.3 27.94,27.55 27.94,18.66 29.21,17.39 J1.P$2
  Bottom 0.406: 32.86,45.65 32.23,46.28 32.23,47.55 32.86,48.19 U$11.4 U$11.11 45.09,48.19 46.35,49.46 46.35,52.63 47.94,54.22 R21.1 | 32.86,45.65 U$11.2 | 32.86,45.65 32.86,44.06 v33.5,43.42
SCL_RX_UC  (via drill 0.7 pad 1.42)
  Top 0.406: R19.1 21.59,60.91 22.23,60.27 23.81,60.27 v25.08,61.54 25.08,62.81 26.35,64.08 26.99,64.08 | 26.99,64.08 27.47,64.08 | D10.1 26.99,64.08
  Bottom 0.406: U$12.3 22.23,58.68 v25.08,61.54 25.4,61.86 29.53,61.86 32.72,58.66 36.83,58.66 37.8,59.63 U$10.2
SCL_TX_UC  (via drill 0.7 pad 1.42)
  Top 0.406: R30.1 22.88,58.37 23.65,59.14 24.99,59.14 v25.4,59.56 26.45,59.56 27.16,60.26 | 27.16,60.26 28.57,58.84 29.84,58.84 30.8,59.79 30.8,61.22 32.7,63.13 v33.02,63.13 | 27.16,60.26 D10.2
  Bottom 0.406: U$12.2 22.86,57.41 25,59.56 v25.4,59.56 | IC1.1 33.32,64.36 33.02,64.06 v33.02,63.13
SDA_IO  (via drill 0.7 pad 1.42)  (1 unrouted)
  Top 0.406: U$3.7 40.97,45.34 41.27,45.65 v43.34,45.65 | 26.67,43.74 C17.1 24.94,44.04 v23.81,45.17 | 26.67,43.74 JP3.4 | J1.P$4 26.67,28.19 28.89,30.41 33.66,30.41 35.24,28.82 35.24,27.87 36.15,26.96 IC6.14 | 26.67,43.74
  Bottom 0.406: R31.1 49.38,48.99 46.04,45.65 v43.34,45.65 U$11.13 39.05,45.65 38.73,45.33 38.73,42.79 37.94,42 32.7,42 32.07,42.63 32.07,43.42 31.43,44.06 | U$11.8 38.89,52 37.62,50.73 U$11.6 34.13,50.73 31.43,48.03 31.43,44.06 | 31.43,44.06 29.53,45.97 24.61,45.97 v23.81,45.17
SDA_RY_UC  (via drill 0.7 pad 1.42)
  Top 0.406: R23.1 15.24,63.45 16.51,62.17 22.86,62.17 v23.16,62.48 26.35,65.67 D11.2
  Bottom 0.406: U$12.5 22.23,61.22 23.16,62.16 v23.16,62.48 23.57,62.89 29.77,62.89 33.02,59.63 36.35,59.63 37.62,60.91 U$10.3
SDA_TY_UC  (via drill 0.7 pad 1.42)
  Top 0.406: R39.1 14.29,65.98 16.83,63.45 21.74,63.45 v25.15,66.86 25.87,67.57 D11.1
  Bottom 0.406: U$12.4 17.46,59.95 15.88,61.54 15.88,65.98 17.78,67.89 20.94,67.89 22.45,66.38 24.68,66.38 | 24.68,66.38 32.46,66.38 33.18,65.67 IC1.3 | v25.15,66.86 24.68,66.38

### Text on the board
tText: EmonRPi by Rupert Dobrounig is licensed under a / Creative Commons Attribution-NonCommercial- / ShareAlike 4.0 International License. / Based on a work at / http://openenergymonitor.org/.
tText: (c) RDOB | Emon3Voltage | v. 1.3 26.05.2014